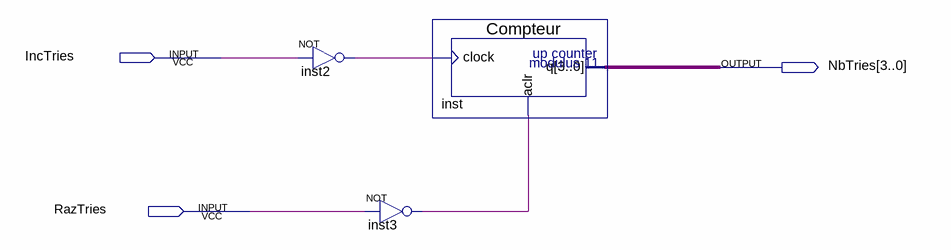
[diagram p0: schematic sheet]
// Quartus schematic ComptageEssai.bdf as structural Verilog: 3 symbols, 3 pins
module ComptageEssai (
  input  IncTries,
  input  RazTries,
  output [3:0] NbTries
);

  wire inst2_out, inst3_out;

  not inst2 (inst2_out, IncTries);
  Compteur inst (.clock(inst2_out), .aclr(inst3_out), .q(NbTries));
  not inst3 (inst3_out, RazTries);
endmodule
